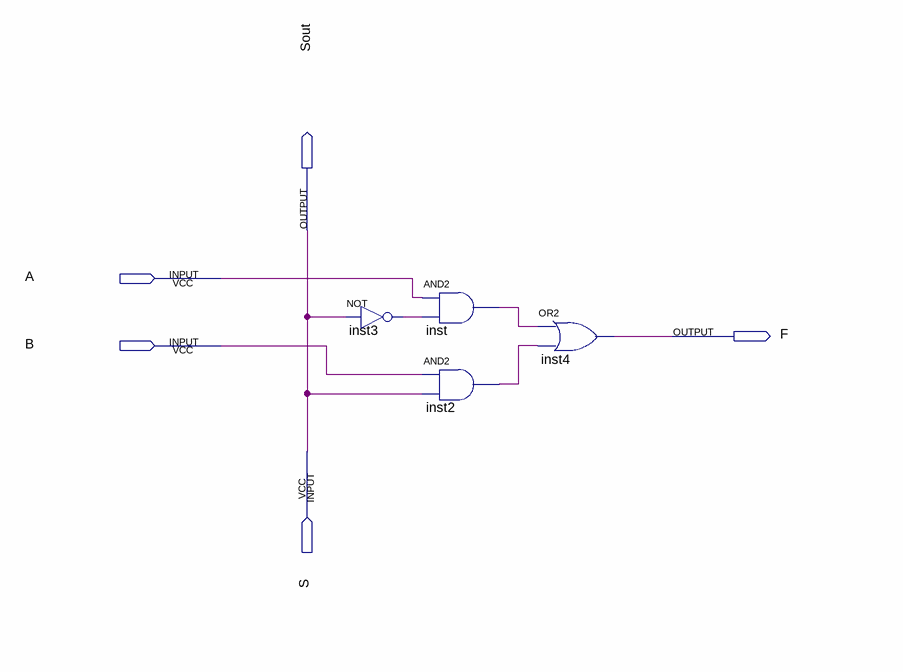
[diagram p0: schematic sheet]
// Quartus schematic Renan_mux_2x1.bdf as structural Verilog: 4 symbols, 5 pins
module Renan_mux_2x1 (
  input  A,
  input  B,
  input  S,
  output Sout,
  output F
);

  wire inst2_out, inst3_out, inst_out;

  not inst3 (inst3_out, S);
  and inst (inst_out, A, inst3_out);
  and inst2 (inst2_out, B, S);
  or inst4 (F, inst_out, inst2_out);

  assign Sout = S;
endmodule
